# EAGLE schematic midi2trigger (EAGLE 6.5.0)
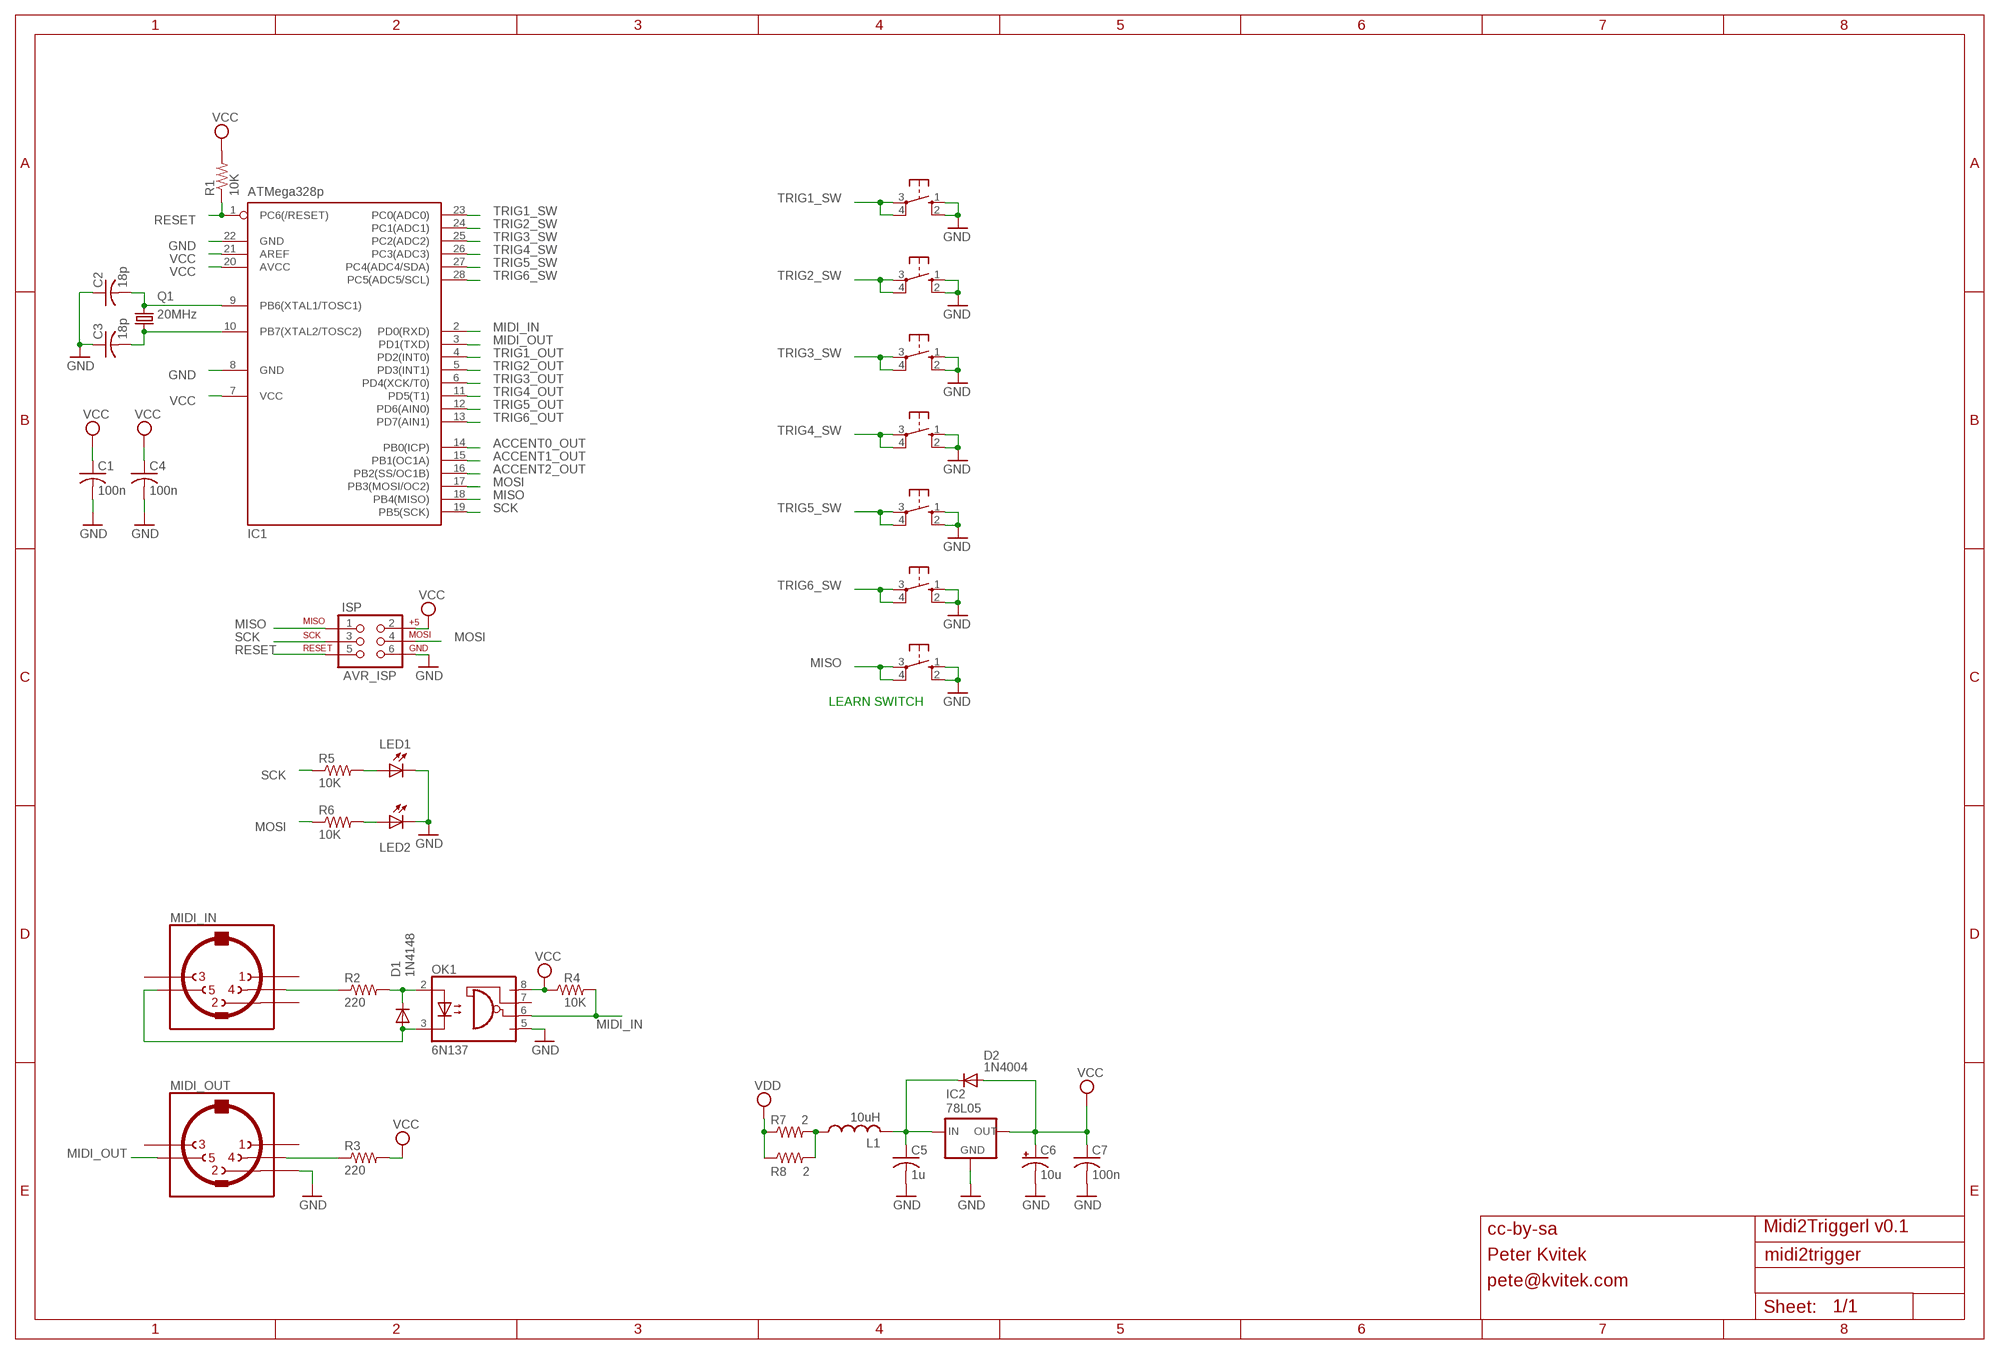
[diagram p0: schematic, sheet 1]

## Parts
C1  100n  C-US025-025X050  [C025-025X050]
C2  18p  C-US025-025X050  [C025-025X050]
C3  18p  C-US025-025X050  [C025-025X050]
C4  100n  C-US025-025X050  [C025-025X050]
C5  1u  C-US025-025X050  [C025-025X050]
C6  10u  CPOL-USE2.5-5  [E2,5-5]
C7  100n  C-US025-025X050  [C025-025X050]
D1  1N4148  DIODE-D-5  [D-5]
D2  1N4004  [DO41-10]
IC1  ATMega328p  MEGA8-P  [DIL28-3]
IC2  78L05  78LXX  [78LXX]
ISP  AVR_ISP  AVR_SPI_PRG_6PTH  [2X3]
L1  10uH  L-US0207/10  [0207/10]
LED1  LED3MM  [LED3MM]
LED2  LED3MM  [LED3MM]
MIDI_IN  MAB5SH  [MAB5SH]
MIDI_OUT  MAB5SH  [MAB5SH]
OK1  6N137  [DIL08]
Q1  20MHz  CRYSTALHC49U-V  [HC49U-V]
R1  10K  R-US_0204/7  [0204/7]
R2  220  R-US_0204/7  [0204/7]
R3  220  R-US_0204/7  [0204/7]
R4  10K  R-US_0204/7  [0204/7]
R5  10K  R-US_0204/7  [0204/7]
R6  10K  R-US_0204/7  [0204/7]
R7  2  R-US_0204/7  [0204/7]
R8  2  R-US_0204/7  [0204/7]
SW1  40-XX  [B3F-40XX]
SW2  40-XX  [B3F-40XX]
SW3  40-XX  [B3F-40XX]
SW4  40-XX  [B3F-40XX]
SW5  40-XX  [B3F-40XX]
SW6  40-XX  [B3F-40XX]
SW7  40-XX  [B3F-40XX]

## Nets
ACCENT0_OUT: IC1.14(PB0(ICP))
ACCENT1_OUT: IC1.15(PB1(OC1A))
ACCENT2_OUT: IC1.16(PB2(SS/OC1B))
GND: C1.2 C2.1 C3.1 C4.2 C5.2 C6.- C7.2 IC1.8(GND) IC1.22(GND) IC2.GND ISP.6 LED1.K(C) LED2.K(C) MIDI_OUT.2 OK1.5(GND) SW1.1(S) SW1.2(S1) SW2.1(S) SW2.2(S1) SW3.1(S) SW3.2(S1) SW4.1(S) SW4.2(S1) SW5.1(S) SW5.2(S1) SW6.1(S) SW6.2(S1) SW7.1(S) SW7.2(S1)
MIDI_IN: IC1.2(PD0(RXD)) OK1.6(VO) R4.2
MIDI_OUT: IC1.3(PD1(TXD)) MIDI_OUT.5
MISO: IC1.18(PB4(MISO)) ISP.1 SW7.3(P) SW7.4(P1)
MOSI: IC1.17(PB3(MOSI/OC2)) ISP.4 R6.1
N$1: L1.1 R7.2 R8.2
N$2: D1.C OK1.2(A) R2.2
N$3: MIDI_OUT.4 R3.1
N$4: LED1.A R5.2
N$5: LED2.A R6.2
N$72: MIDI_IN.4 R2.1
N$73: D1.A MIDI_IN.5 OK1.3(C)
N$82: C3.2 IC1.10(PB7(XTAL2/TOSC2)) Q1.1
N$83: C2.2 IC1.9(PB6(XTAL1/TOSC1)) Q1.2
RESET: IC1.1(PC6(/RESET)) ISP.5 R1.1
SCK: IC1.19(PB5(SCK)) ISP.3 R5.1
TRIG1_OUT: IC1.4(PD2(INT0))
TRIG1_SW: IC1.23(PC0(ADC0)) SW1.3(P) SW1.4(P1)
TRIG2_OUT: IC1.5(PD3(INT1))
TRIG2_SW: IC1.24(PC1(ADC1)) SW2.3(P) SW2.4(P1)
TRIG3_OUT: IC1.6(PD4(XCK/T0))
TRIG3_SW: IC1.25(PC2(ADC2)) SW3.3(P) SW3.4(P1)
TRIG4_OUT: IC1.11(PD5(T1))
TRIG4_SW: IC1.26(PC3(ADC3)) SW4.3(P) SW4.4(P1)
TRIG5_OUT: IC1.12(PD6(AIN0))
TRIG5_SW: IC1.27(PC4(ADC4/SDA)) SW5.3(P) SW5.4(P1)
TRIG6_OUT: IC1.13(PD7(AIN1))
TRIG6_SW: IC1.28(PC5(ADC5/SCL)) SW6.3(P) SW6.4(P1)
VCC: C1.1 C4.1 C6.+ C7.1 D2.A IC1.7(VCC) IC1.20(AVCC) IC1.21(AREF) IC2.OUT ISP.2 OK1.8(VCC) R1.2 R3.2 R4.1
VDD: R7.1 R8.1
VREG_IN: C5.1 D2.C IC2.IN L1.2
Unconnected: MIDI_IN.1 MIDI_IN.2 MIDI_IN.3 MIDI_OUT.1 MIDI_OUT.3 OK1.7(VE)

## Notes on the sheet
- LEARN SWITCH
- cc-by-sa | Midi2Triggerl v0.1
- Peter Kvitek
- pete@kvitek.com

## Library data of the parts
C1-C5 C7 = rcl:C-US: CAPACITOR, American symbol
C6 = rcl:CPOL-US: POLARIZED CAPACITOR, American symbol
D1 = diode:DIODE-: DIODE
D2 = diode:1N4004: DIODE general purpose rectifier, 1 A
IC1 = atmel:MEGA8-P: MICROCONTROLLER 8 Kbytes FLASH, 1 kbytes SRAM, 512 bytes EEPROM, USART, 4-channel 10 bit ADC, 2-channel 8 bit ADC Pin compatible with Atmega48, ATMega88, ATMega168 Source: avr.lbr; OC_FARNELL: unknown; OC_NEWARK: unknown
IC2 = v-reg:78LXX: VOLTAGE REGULATOR
ISP = SparkFun:AVR_SPI_PRG_6: AVR ISP 6 Pin This is the reduced ISP connector for AVR programming. Common on Arduino. This footprint will take up less PCB space and can be used with a 10-pin to 6-pin adapter such as SKU: BOB-08508
L1 = rcl:L-US: INDUCTOR, American symbol
LED1 LED2 = led:LED: LED OSRAM: - CHIPLED LG R971, LG N971, LY N971, LG Q971, LY Q971, LO R971, LY R971 LH N974, LH R974 LS Q976, LO Q976, LY Q976 LO Q996 - Hyper CHIPLED LW Q18S LB Q993, LB Q99A, LB R99A - SideLED LS A670, LO A670, LY A670, LG A670, LP A670 LB A673, LV A673, LT A673, LW A673 LH A674 LY A675 LS A676, LA A676, LO A676, LY A676, LW A676 LS A679, LY A679, LG A679 - Hyper Micro SIDELED® LS Y876, LA Y876, LO Y876, LY Y876 LT Y87S - SmartLED LW L88C, LW L88S LB L89C, LB L89S, LG L890 LS L89K, LO L89K, LY L89K LS L896, LA L896, LO L896, LY L896 - TOPLED LS T670, LO T670, LY T670, LG T670, LP T670 LSG T670, LSP T670, LSY T670, LOP T670, LYG T670 LG T671, LOG T671, LSG T671 LB T673, LV T673, LT T673, LW T673 LH T674 LS T676, LA T676, LO T676, LY T676, LB T676, LH T676, LSB T676, LW T676 LB T67C, LV T67C, LT T67C, LS T67K, LO T67K, LY T67K, LW E67C LS E67B, LA E67B, LO E67B, LY E67B, LB E67C, LV E67C, LT E67C LW T67C LS T679, LY T679, LG T679 LS T770, LO T770, LY T770, LG T770, LP T770 LB T773, LV T773, LT T773, LW T773 LH T774 LS E675, LA E675, LY E675, LS T675 LS T776, LA T776, LO T776, LY T776, LB T776 LHGB T686 LT T68C, LB T68C - Hyper Mini TOPLED® LB M676 - Mini TOPLED Santana® LG M470 LS M47K, LO M47K, LY M47K Source: http://www.osram.convergy.de LUXEON: - LUMILED® LXK2-PW12-R00, LXK2-PW12-S00, LXK2-PW14-U00, LXK2-PW14-V00 LXK2-PM12-R00, LXK2-PM12-S00, LXK2-PM14-U00 LXK2-PE12-Q00, LXK2-PE12-R00, LXK2-PE12-S00, LXK2-PE14-T00, LXK2-PE14-U00 LXK2-PB12-K00, LXK2-PB12-L00, LXK2-PB12-M00, LXK2-PB14-N00, LXK2-PB14-P00, LXK2-PB14-Q00 LXK2-PR12-L00, LXK2-PR12-M00, LXK2-PR14-Q00, LXK2-PR14-R00 LXK2-PD12-Q00, LXK2-PD12-R00, LXK2-PD12-S00 LXK2-PH12-R00, LXK2-PH12-S00 LXK2-PL12-P00, LXK2-PL12-Q00, LXK2-PL12-R00 Source: www.luxeon.com KINGBRIGHT: KA-3528ASYC Source: www.kingbright.com
MIDI_IN MIDI_OUT = og-midi:MAB5SH: Female CONNECTOR 5 pins 90 deg. with shield, horizontal (DIN 41524)
OK1 = kvitekp:6N137: MOTOROLA OPTO COUPLER; MPN: 6N137; OC_FARNELL: 1328376; OC_NEWARK: 52M1895
Q1 = crystal:CRYSTAL: CRYSTAL; OC_FARNELL: 1666969; OC_NEWARK: unknown
R1-R8 = rcl:R-US_: RESISTOR, American symbol
SW1-SW7 = og-switch:40-XX: OMRON SWITCH